# EAGLE schematic bjt-general (EAGLE 9.6.1)
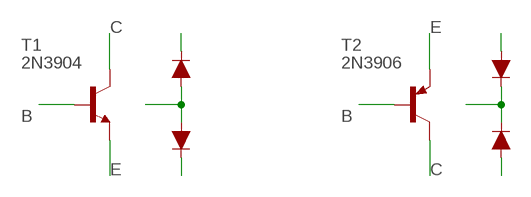
[diagram p0: schematic, sheet 1]

## Parts
D1  200mA/100V/1V  DIODE-1N4148  [DIODE-1N4148]
D2  200mA/100V/1V  DIODE-1N4148  [DIODE-1N4148]
D3  200mA/100V/1V  DIODE-1N4148  [DIODE-1N4148]
D4  200mA/100V/1V  DIODE-1N4148  [DIODE-1N4148]
T1  2N3904  [TO92]
T2  2N3906  [TO92]

## Nets
B: T1.2(B) T2.2(B)
C: T1.1(C) T2.1(C)
E: T1.3(E) T2.3(E)
N$1: D1.A D2.A
N$2: D1.C
N$3: D2.C
N$4: D3.C D4.C
N$5: D3.A
N$6: D4.A

## Library data of the parts
D1-D4 = SparkFun-DiscreteSemi:DIODE: Diode These are standard reverse protection diodes and small signal diodes. SparkFun Products: SparkFun SparkPunk Sound Kit <https://www.sparkfun.com/products/11177> SparkFun ESP8266 Thing <https://www.sparkfun.com/products/13231>; PROD_ID: DIO-08378
T1 = transistor:2N3904: NPN TRANSISTOR
T2 = transistor-pnp:2N3906: PNP Transistor